# EAGLE design DBG-002 (EAGLE 9.6.0)
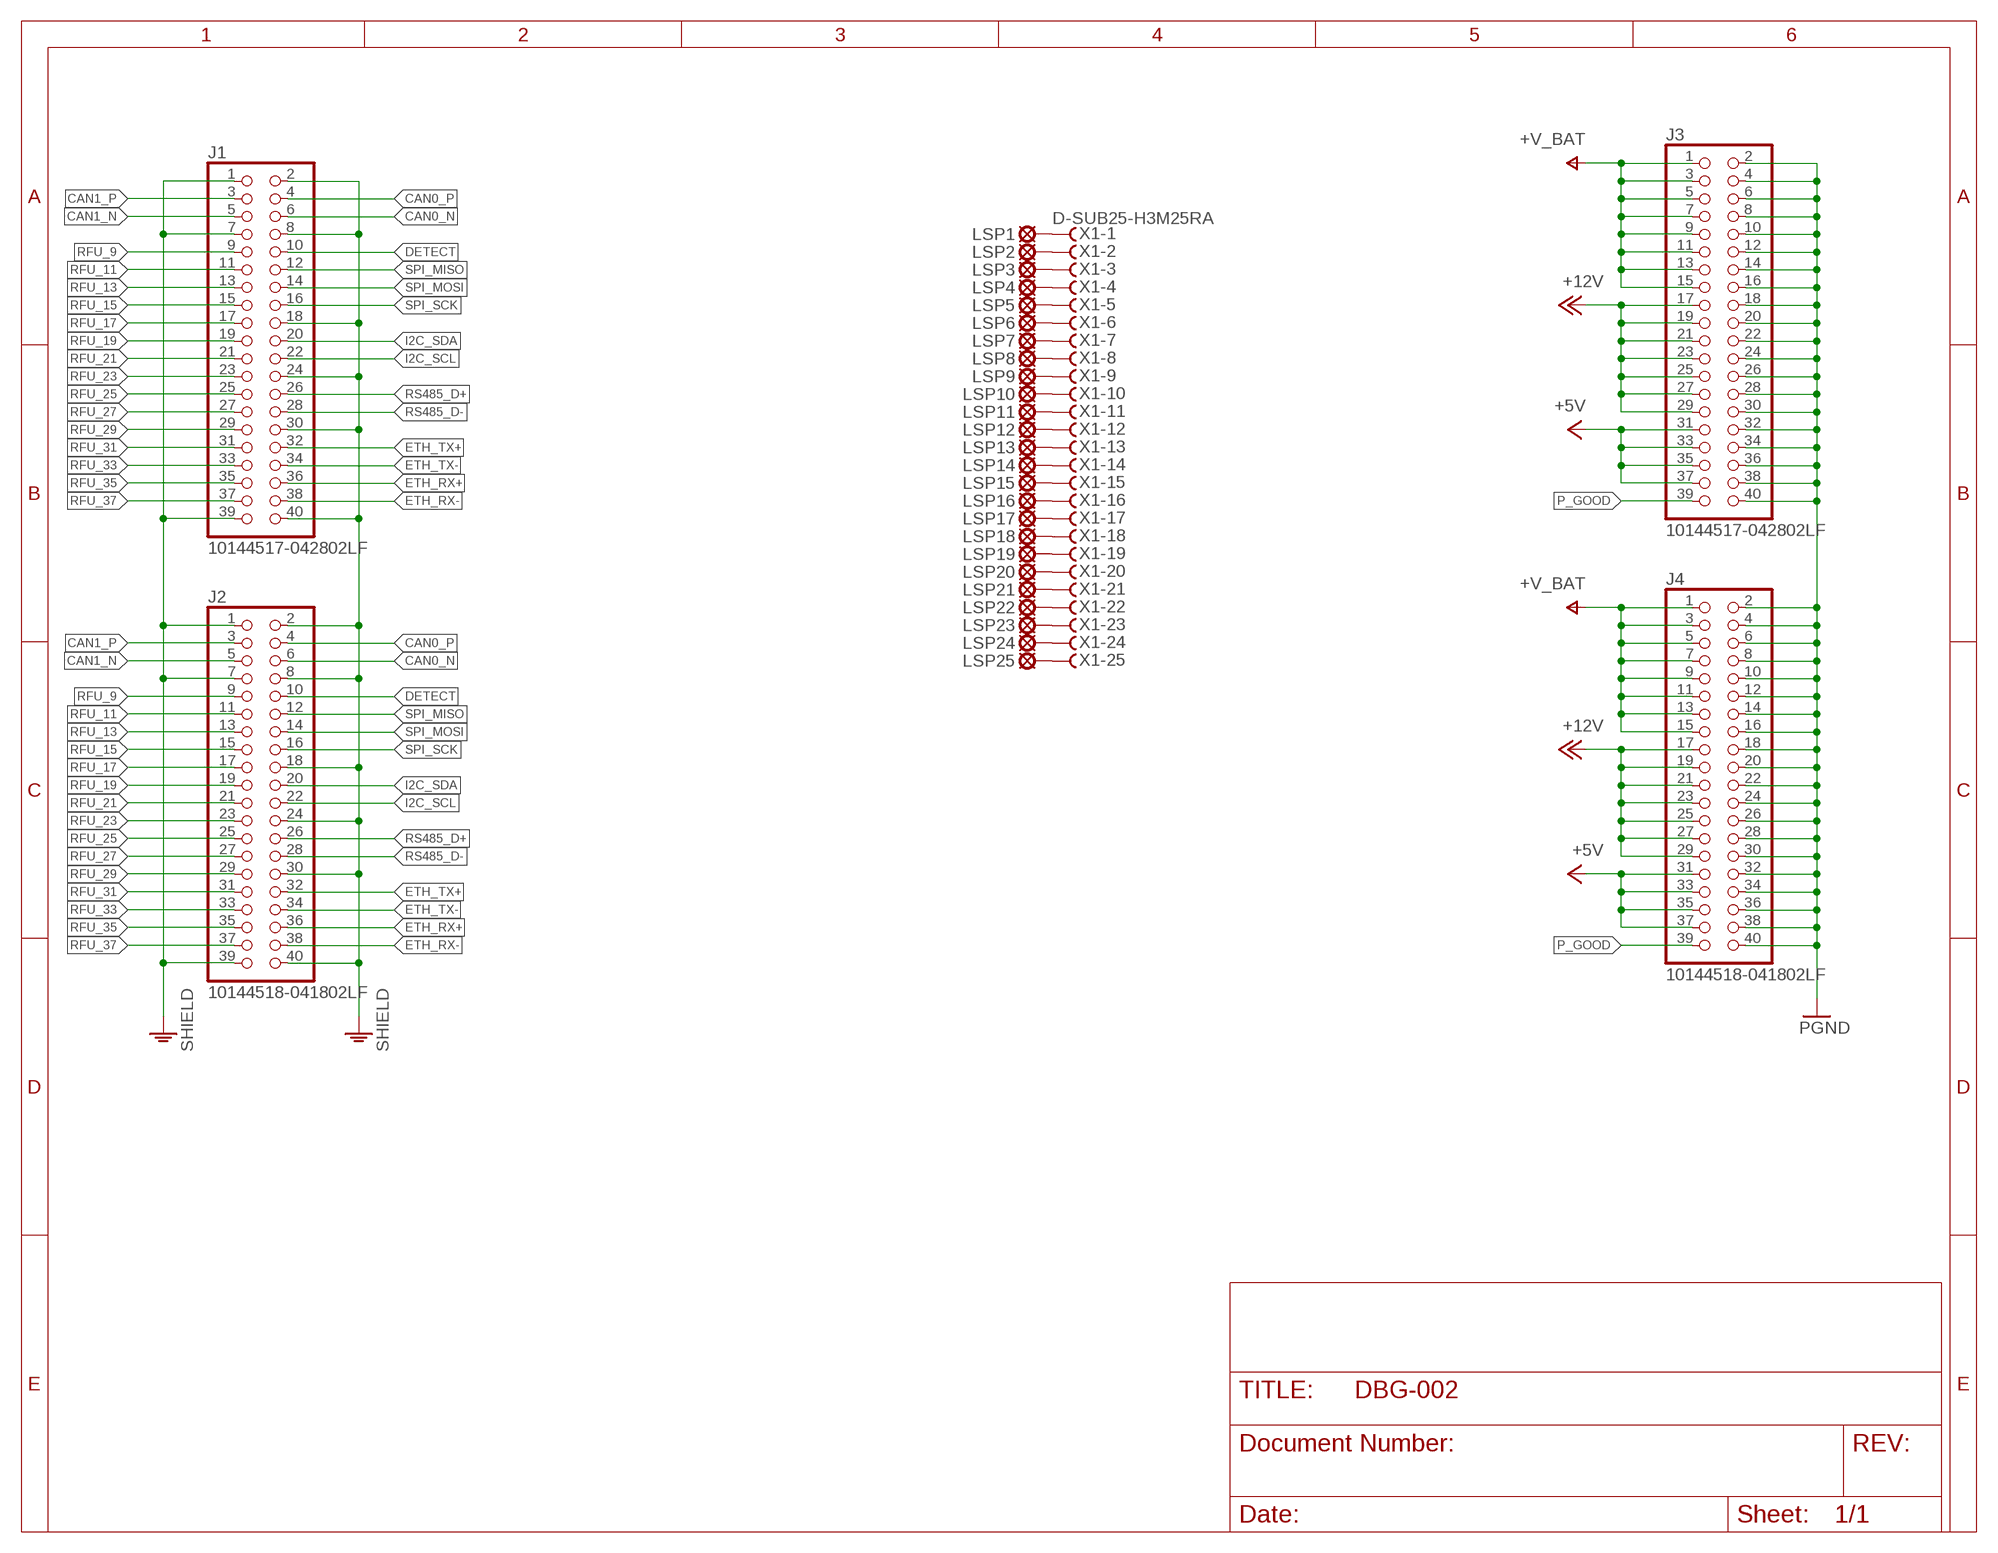
[diagram p0: schematic, sheet 1]

## Parts
J1  10144517-042802LF  [10144517-042802LF]
J2  10144518-041802LF  [10144518-041802LF]
J3  10144517-042802LF  [10144517-042802LF]
J4  10144518-041802LF  [10144518-041802LF]
LSP1  LSP11  [LSP11]
LSP2  LSP11  [LSP11]
LSP3  LSP11  [LSP11]
LSP4  LSP11  [LSP11]
LSP5  LSP11  [LSP11]
LSP6  LSP11  [LSP11]
LSP7  LSP11  [LSP11]
LSP8  LSP11  [LSP11]
LSP9  LSP11  [LSP11]
LSP10  LSP11  [LSP11]
LSP11  LSP11  [LSP11]
LSP12  LSP11  [LSP11]
LSP13  LSP11  [LSP11]
LSP14  LSP11  [LSP11]
LSP15  LSP11  [LSP11]
LSP16  LSP11  [LSP11]
LSP17  LSP11  [LSP11]
LSP18  LSP11  [LSP11]
LSP19  LSP11  [LSP11]
LSP20  LSP11  [LSP11]
LSP21  LSP11  [LSP11]
LSP22  LSP11  [LSP11]
LSP23  LSP11  [LSP11]
LSP24  LSP11  [LSP11]
LSP25  LSP11  [LSP11]
X1  D-SUB25-H3M25RA  [H3M25RA]

## Nets
+5V: J3.31 J3.33 J3.35 J3.37 J4.31 J4.33 J4.35 J4.37
+12V: J3.17 J3.19 J3.21 J3.23 J3.25 J3.27 J3.29 J4.17 J4.19 J4.21 J4.23 J4.25 J4.27 J4.29
+V_BAT: J3.1 J3.3 J3.5 J3.7 J3.9 J3.11 J3.13 J3.15 J4.1 J4.3 J4.5 J4.7 J4.9 J4.11 J4.13 J4.15
CAN0_N: J1.6 J2.6
CAN0_P: J1.4 J2.4
CAN1_N: J1.5 J2.5
CAN1_P: J1.3 J2.3
DETECT: J1.10 J2.10
ETH_RX+: J1.36 J2.36
ETH_RX-: J1.38 J2.38
ETH_TX+: J1.32 J2.32
ETH_TX-: J1.34 J2.34
I2C_SCL: J1.22 J2.22
I2C_SDA: J1.20 J2.20
N$1: LSP1.MP X1.1
N$2: LSP2.MP X1.2
N$3: LSP3.MP X1.3
N$6: LSP4.MP X1.4
N$7: LSP5.MP X1.5
N$8: LSP6.MP X1.6
N$9: LSP7.MP X1.7
N$10: LSP8.MP X1.8
N$11: LSP9.MP X1.9
N$13: LSP10.MP X1.10
N$14: LSP11.MP X1.11
N$15: LSP12.MP X1.12
N$16: LSP13.MP X1.13
N$17: LSP14.MP X1.14
N$18: LSP15.MP X1.15
N$20: LSP16.MP X1.16
N$21: LSP17.MP X1.17
N$22: LSP18.MP X1.18
N$23: LSP19.MP X1.19
N$24: LSP20.MP X1.20
N$25: LSP21.MP X1.21
N$26: LSP22.MP X1.22
N$27: LSP23.MP X1.23
N$28: LSP24.MP X1.24
N$29: LSP25.MP X1.25
P_GOOD: J3.39 J4.39
PGND: J3.2 J3.4 J3.6 J3.8 J3.10 J3.12 J3.14 J3.16 J3.18 J3.20 J3.22 J3.24 J3.26 J3.28 J3.30 J3.32 J3.34 J3.36 J3.38 J3.40 J4.2 J4.4 J4.6 J4.8 J4.10 J4.12 J4.14 J4.16 J4.18 J4.20 J4.22 J4.24 J4.26 J4.28 J4.30 J4.32 J4.34 J4.36 J4.38 J4.40
RFU_9: J1.9 J2.9
RFU_11: J1.11 J2.11
RFU_13: J1.13 J2.13
RFU_15: J1.15 J2.15
RFU_17: J1.17 J2.17
RFU_19: J1.19 J2.19
RFU_21: J1.21 J2.21
RFU_23: J1.23 J2.23
RFU_25: J1.25 J2.25
RFU_27: J1.27 J2.27
RFU_29: J1.29 J2.29
RFU_31: J1.31 J2.31
RFU_33: J1.33 J2.33
RFU_35: J1.35 J2.35
RFU_37: J1.37 J2.37
RS485_D+: J1.26 J2.26
RS485_D-: J1.28 J2.28
SHIELD: J1.1 J1.2 J1.7 J1.8 J1.18 J1.24 J1.30 J1.39 J1.40 J2.1 J2.2 J2.7 J2.8 J2.18 J2.24 J2.30 J2.39 J2.40
SPI_MISO: J1.12 J2.12
SPI_MOSI: J1.14 J2.14
SPI_SCK: J1.16 J2.16

## Library data of the parts
J1 J3 = BergStak:10144517-04
J2 J4 = BergStak:10144518-04
LSP1-LSP25 = solpad:LSP11: SOLDER PAD drill 1.1 mm
X1 = con-thomas-betts:D-SUB25-: D-Subminiatur Connector Source: Electronioc Interconnects European Edition 1998; OC_FARNELL: unknown; OC_NEWARK: unknown

## Board
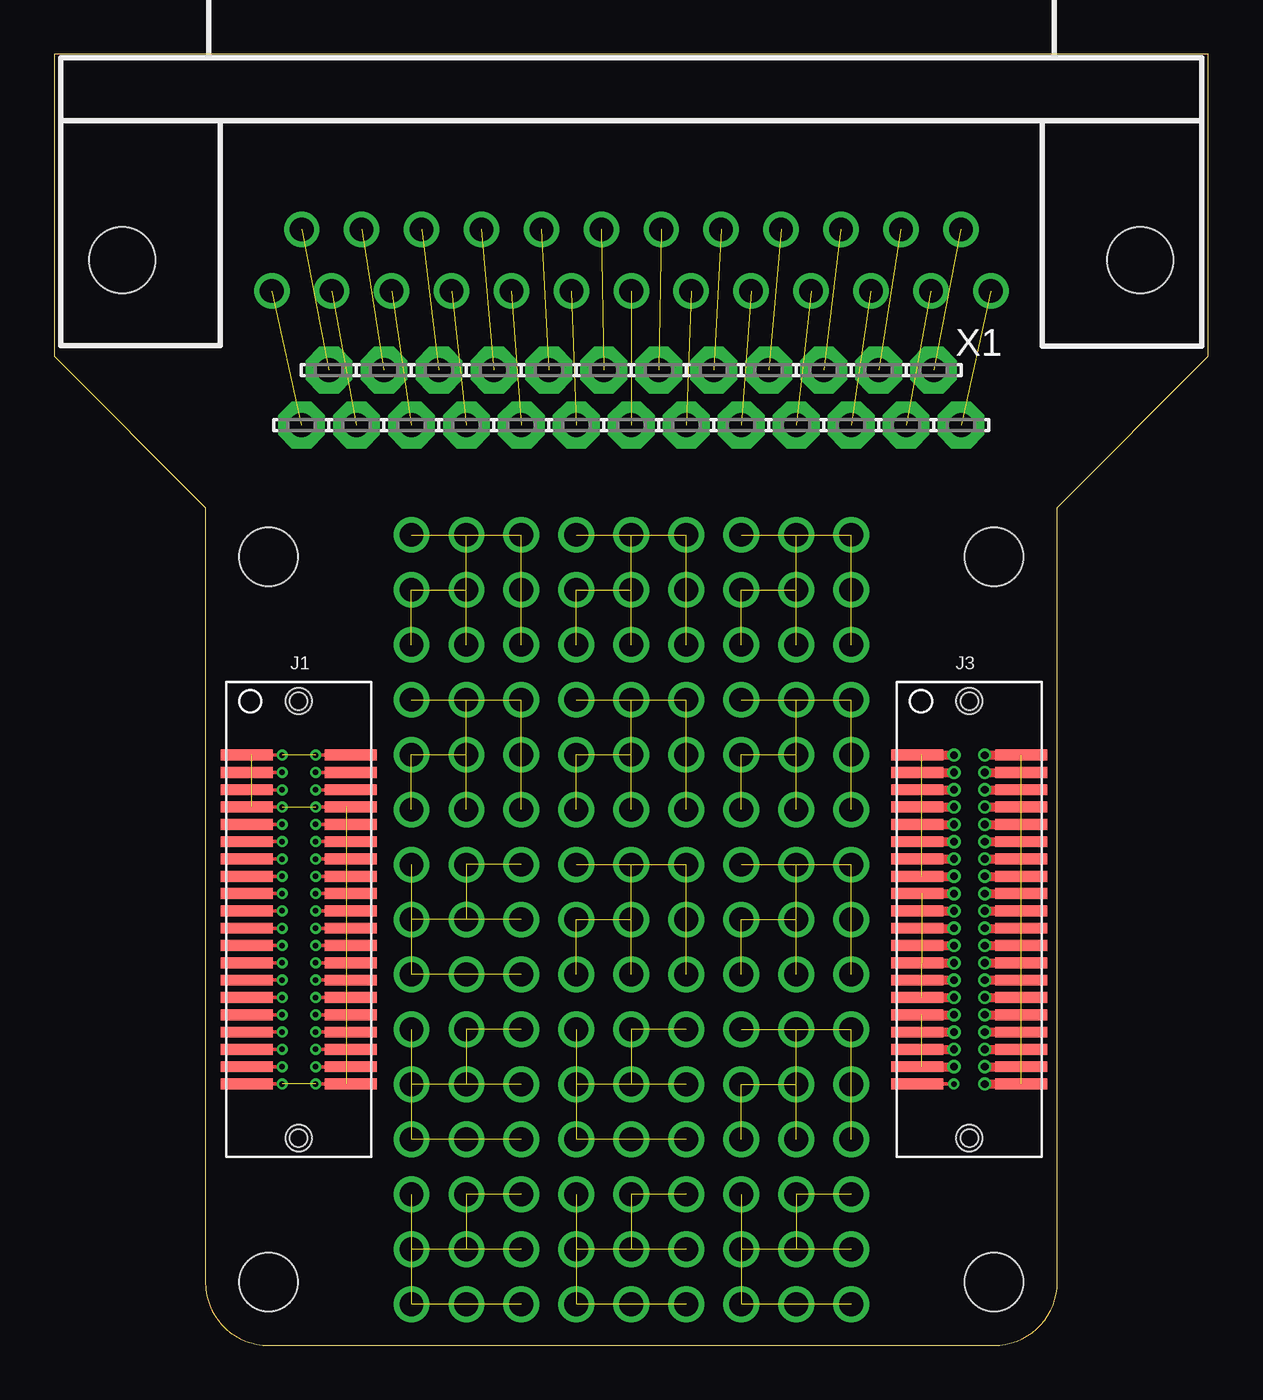
[diagram p1: board, top side]
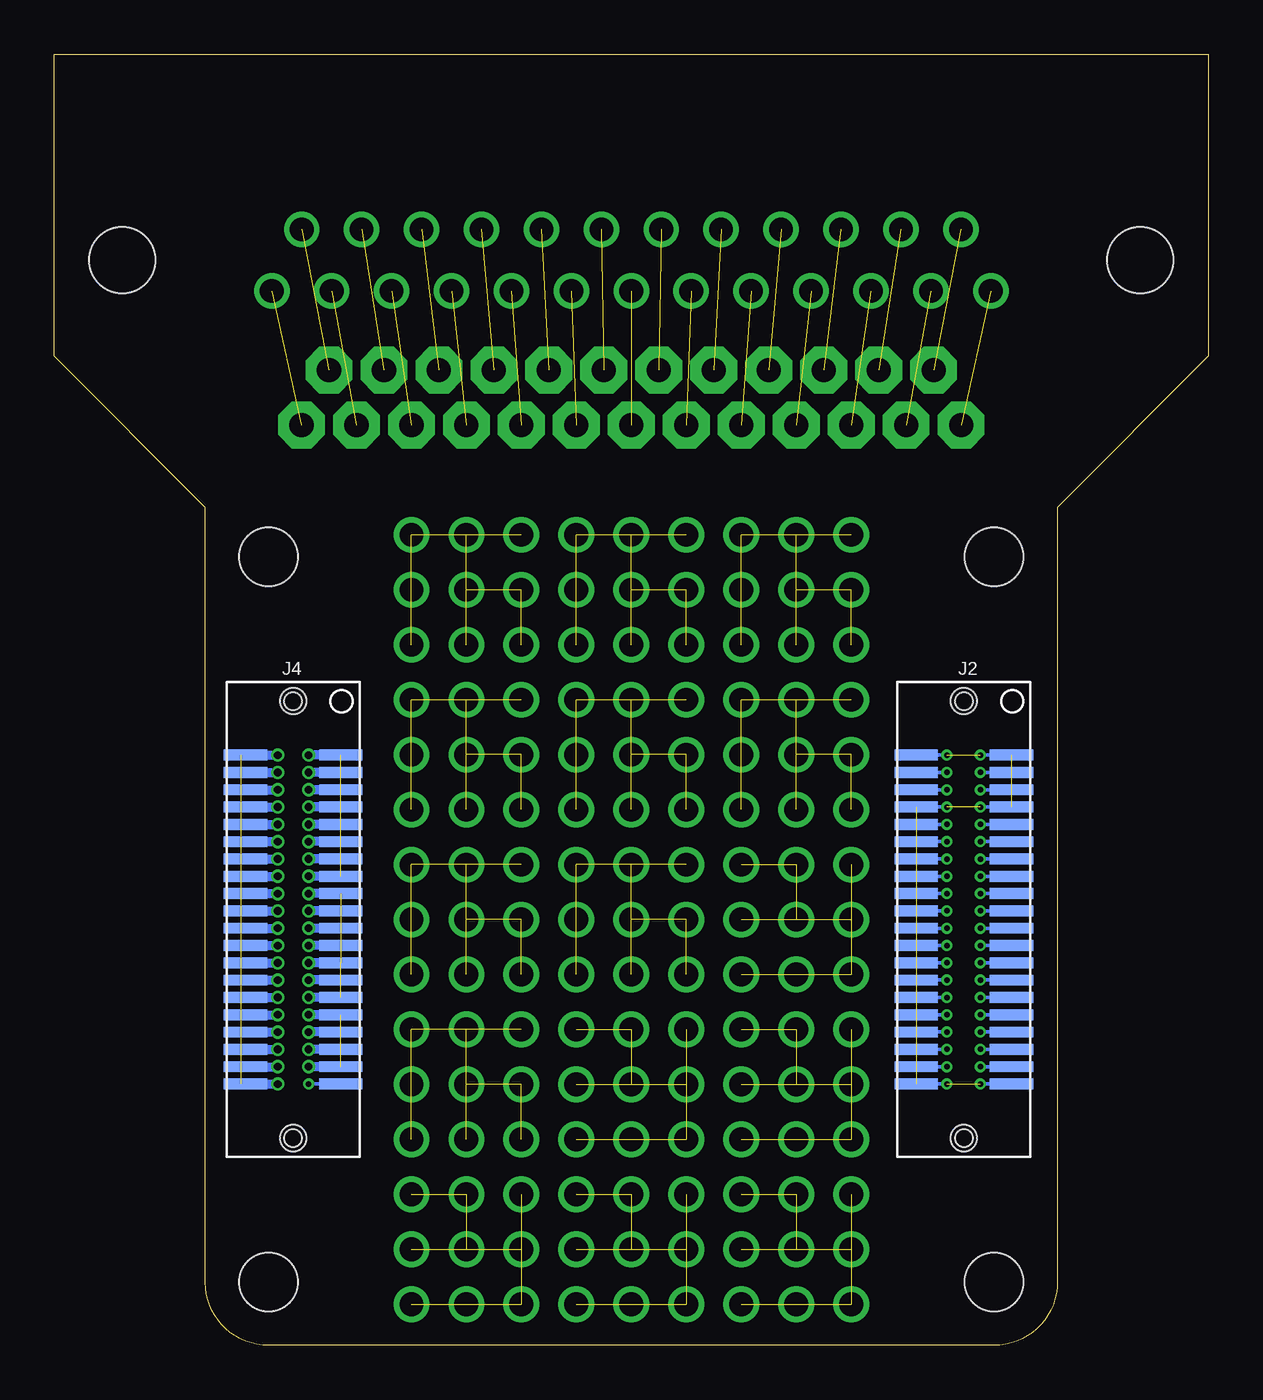
[diagram p2: board, bottom side, seen from below]

Size 53.34 x 59.69 mm. Coordinates in mm from the lower left corner, seen from the top.
Outline: 6.99,36.45 6.99,2.92 arc90 9.91,0 43.43,0 arc90 46.36,2.92 46.36,36.45 46.36,38.73 53.34,45.72 53.34,59.69 0,59.69 0,45.72 6.99,38.73 6.99,36.45
Copper layers (1*16): Top 0.035559375mm / dielectric 1.6mm / Bottom 0.035559375mm
Design rules "oshpark-2layer": minimum track width 6mil, minimum drill 10mil, track to track 6mil, track to pad 6mil, pad to pad 6mil, via to via 6mil, smd to smd 6mil, copper to edge 15mil, drill to drill 6mil, minimum pad ring 5mil, minimum via ring 5mil, stop-mask expansion 2.5mil, vias tented up to drill 0mil, thermal gap 10mil
Holes 2.69 mm at 9.91,36.45 43.43,36.45 43.43,2.92 9.91,2.92
vRestrict: area 26.7,19.7 to 32.5,25.5; area 60.2,19.7 to 66,25.5; area 60.2,53.2 to 66,59.1; area 26.7,53.2 to 32.5,59.1

### Footprints (pad centres in the part's own frame; a part is rotated, then mirrored left to right if it is on the bottom)
10144517-042802LF = smd 0.5 x 2.4: 1 7.6,2.4; 2 7.6,-2.4; 3 6.8,2.4; 4 6.8,-2.4; 5 6,2.4; 6 6,-2.4; 7 5.2,2.4; 8 5.2,-2.4; 9 4.4,2.4; 10 4.4,-2.4; 11 3.6,2.4; 12 3.6,-2.4; 13 2.8,2.4; 14 2.8,-2.4; 15 2,2.4; 16 2,-2.4; 17 1.2,2.4; 18 1.2,-2.4; 19 0.4,2.4; 20 0.4,-2.4; 21 -0.4,2.4; 22 -0.4,-2.4; 23 -1.2,2.4; 24 -1.2,-2.4; 25 -2,2.4; 26 -2,-2.4; 27 -2.8,2.4; 28 -2.8,-2.4; 29 -3.6,2.4; 30 -3.6,-2.4; 31 -4.4,2.4; 32 -4.4,-2.4; 33 -5.2,2.4; 34 -5.2,-2.4; 35 -6,2.4; 36 -6,-2.4; 37 -6.8,2.4; 38 -6.8,-2.4; 39 -7.6,2.4; 40 -7.6,-2.4 | hole 1.2: 10.1,0 | hole 0.8: -10.1,0
10144518-041802LF = smd 0.5 x 2: 1 -7.6,2.2; 2 -7.6,-2.2; 3 -6.8,2.2; 4 -6.8,-2.2; 5 -6,2.2; 6 -6,-2.2; 7 -5.2,2.2; 8 -5.2,-2.2; 9 -4.4,2.2; 10 -4.4,-2.2; 11 -3.6,2.2; 12 -3.6,-2.2; 13 -2.8,2.2; 14 -2.8,-2.2; 15 -2,2.2; 16 -2,-2.2; 17 -1.2,2.2; 18 -1.2,-2.2; 19 -0.4,2.2; 20 -0.4,-2.2; 21 0.4,2.2; 22 0.4,-2.2; 23 1.2,2.2; 24 1.2,-2.2; 25 2,2.2; 26 2,-2.2; 27 2.8,2.2; 28 2.8,-2.2; 29 3.6,2.2; 30 3.6,-2.2; 31 4.4,2.2; 32 4.4,-2.2; 33 5.2,2.2; 34 5.2,-2.2; 35 6,2.2; 36 6,-2.2; 37 6.8,2.2; 38 6.8,-2.2; 39 7.6,2.2; 40 7.6,-2.2 | hole 1.2: 10.1,0 | hole 0.8: -10.1,0
LSP11 = drill 1.118 pad 2.159 octagon: MP 0,0
H3M25RA = drill 1.092: 1 -16.612,1.422; 2 -13.843,1.422; 3 -11.074,1.422; 4 -8.306,1.422; 5 -5.537,1.422; 6 -2.769,1.422; 7 0,1.422; 8 2.769,1.422; 9 5.537,1.422; 10 8.306,1.422; 11 11.074,1.422; 12 13.843,1.422; 13 16.612,1.422; 14 -15.227,-1.422; 15 -12.459,-1.422; 16 -9.69,-1.422; 17 -6.921,-1.422; 18 -4.153,-1.422; 19 -1.384,-1.422; 20 1.384,-1.422; 21 4.153,-1.422; 22 6.921,-1.422; 23 9.69,-1.422; 24 12.459,-1.422; 25 15.227,-1.422 | hole 3.048: -23.52,0; 23.52,0

### Placement (x,y rotation side)
J1  11.3,19.68 90 top
J2  11.3,19.68 270 bottom
J3  42.29,19.68 90 top
J4  42.29,19.68 270 bottom
LSP1  41.91,42.55 180 top
LSP2  39.37,42.55 180 top
LSP3  36.83,42.55 180 top
LSP4  34.29,42.55 180 top
LSP5  31.75,42.55 180 top
LSP6  29.21,42.55 180 top
LSP7  26.67,42.55 180 top
LSP8  24.13,42.55 180 top
LSP9  21.59,42.55 180 top
LSP10  19.05,42.55 180 top
LSP11  16.51,42.55 180 top
LSP12  13.97,42.55 180 top
LSP13  11.43,42.55 180 top
LSP14  40.64,45.08 180 top
LSP15  38.1,45.08 180 top
LSP16  35.56,45.08 180 top
LSP17  33.02,45.08 180 top
LSP18  30.48,45.08 180 top
LSP19  27.94,45.08 180 top
LSP20  25.4,45.08 180 top
LSP21  22.86,45.08 180 top
LSP22  20.32,45.08 180 top
LSP23  17.78,45.08 180 top
LSP24  15.24,45.08 180 top
LSP25  12.7,45.08 180 top
X1  26.67,50.16 180 top

### Tracks (layer width: path | path; a pad name or v marks a point on that pad's centre or on a via)
+5V  (via drill 0.36)  (3 unrouted)
  Top 0.406: J3.37 v41.58,12.88 | J3.35 v41.58,13.68 | J3.33 v41.58,14.48 | J3.31 v41.58,15.28
  Bottom 0.406: J4.37 v41.58,12.88 | J4.35 v41.58,13.68 | J4.33 v41.58,14.48 | J4.31 v41.58,15.28
+12V  (via drill 0.36)  (6 unrouted)
  Top 0.406: J3.29 v41.58,16.08 | J3.27 v41.58,16.88 | J3.25 v41.58,17.68 | J3.23 v41.58,18.48 | J3.21 v41.58,19.29 | J3.19 v41.58,20.08 | J3.17 v41.58,20.88
  Bottom 0.406: J4.29 v41.58,16.08 | J4.27 v41.58,16.88 | J4.25 v41.58,17.68 | J4.23 v41.58,18.48 | J4.21 v41.58,19.29 | J4.19 v41.58,20.08 | J4.17 v41.58,20.88
+V_BAT  (via drill 0.36)  (7 unrouted)
  Top 0.406: J3.1 v41.58,27.28 | J3.3 v41.58,26.48 | J3.5 v41.58,25.68 | J3.7 v41.58,24.88 | J3.9 v41.58,24.09 | J3.11 v41.58,23.29 | J3.13 v41.58,22.48 | J3.15 v41.58,21.68
  Bottom 0.406: J4.1 v41.58,27.28 | J4.3 v41.58,26.48 | J4.5 v41.58,25.68 | J4.7 v41.58,24.88 | J4.9 v41.58,24.09 | J4.11 v41.58,23.29 | J4.13 v41.58,22.48 | J4.15 v41.58,21.68
CAN0_N  (via drill 0.25)
  Top 0.152: v12.09,25.68 J1.6
  Bottom 0.152: v12.09,25.68 J2.6
CAN0_P  (via drill 0.25)
  Top 0.152: v12.09,26.48 J1.4
  Bottom 0.152: J2.4 v12.09,26.48
CAN1_N  (via drill 0.25)
  Top 0.152: J1.5 v10.54,25.68
  Bottom 0.152: v10.54,25.68 J2.5
CAN1_P  (via drill 0.25)
  Top 0.152: J1.3 v10.54,26.48
  Bottom 0.152: v10.54,26.48 J2.3
DETECT  (via drill 0.25)
  Top 0.152: v12.09,24.09 J1.10
  Bottom 0.152: J2.10 v12.09,24.09
ETH_RX+  (via drill 0.25)
  Top 0.152: v12.09,13.68 J1.36
  Bottom 0.152: J2.36 v12.09,13.68
ETH_RX-  (via drill 0.25)
  Top 0.152: v12.09,12.88 J1.38
  Bottom 0.152: J2.38 v12.09,12.88
ETH_TX+  (via drill 0.25)
  Top 0.152: v12.09,15.28 J1.32
  Bottom 0.152: J2.32 v12.09,15.28
ETH_TX-  (via drill 0.25)
  Top 0.152: v12.09,14.48 J1.34
  Bottom 0.152: J2.34 v12.09,14.48
I2C_SCL  (via drill 0.25)
  Top 0.152: v12.09,19.29 J1.22
  Bottom 0.152: J2.22 v12.09,19.29
I2C_SDA  (via drill 0.25)
  Top 0.152: v12.09,20.08 J1.20
  Bottom 0.152: J2.20 v12.09,20.08
N$1  (1 unrouted)
N$2  (1 unrouted)
N$3  (1 unrouted)
N$4  (via drill 1.1)  (8 unrouted)
  other vias: 26.67,19.68 26.67,22.22 24.13,22.22 24.13,19.68 29.21,19.68 29.21,22.22 24.13,17.14 26.67,17.14 29.21,17.14
N$5  (via drill 1.1)  (8 unrouted)
  other vias: 26.67,27.3 26.67,29.84 24.13,29.84 24.13,27.3 29.21,27.3 29.21,29.84 24.13,24.77 26.67,24.77 29.21,24.77
N$6  (1 unrouted)
N$7  (1 unrouted)
N$8  (1 unrouted)
N$9  (1 unrouted)
N$10  (1 unrouted)
N$11  (1 unrouted)
N$12  (via drill 1.1)  (8 unrouted)
  other vias: 34.29,27.3 34.29,29.84 31.75,29.84 31.75,27.3 36.83,27.3 36.83,29.84 31.75,24.77 34.29,24.77 36.83,24.77
N$13  (1 unrouted)
N$14  (1 unrouted)
N$15  (1 unrouted)
N$16  (1 unrouted)
N$17  (1 unrouted)
N$18  (1 unrouted)
N$19  (via drill 1.1)  (8 unrouted)
  other vias: 34.29,19.68 34.29,22.22 31.75,22.22 31.75,19.68 36.83,19.68 36.83,22.22 31.75,17.14 34.29,17.14 36.83,17.14
N$20  (1 unrouted)
N$21  (1 unrouted)
N$22  (1 unrouted)
N$23  (1 unrouted)
N$24  (1 unrouted)
N$25  (1 unrouted)
N$26  (1 unrouted)
N$27  (1 unrouted)
N$28  (1 unrouted)
N$29  (1 unrouted)
N$30  (via drill 1.1)  (8 unrouted)
  other vias: 34.29,12.06 34.29,14.6 31.75,14.6 31.75,12.06 36.83,12.06 36.83,14.6 31.75,9.52 34.29,9.52 36.83,9.52
N$31  (via drill 1.1)  (8 unrouted)
  other vias: 26.67,12.06 26.67,14.6 24.13,14.6 24.13,12.06 29.21,12.06 29.21,14.6 24.13,9.52 26.67,9.52 29.21,9.52
N$32  (via drill 1.1)  (8 unrouted)
  other vias: 19.05,12.06 19.05,14.6 16.51,14.6 16.51,12.06 21.59,12.06 21.59,14.6 16.51,9.52 19.05,9.52 21.59,9.52
N$33  (via drill 1.1)  (8 unrouted)
  other vias: 19.05,19.68 19.05,22.22 16.51,22.22 16.51,19.68 21.59,19.68 21.59,22.22 16.51,17.14 19.05,17.14 21.59,17.14
N$34  (via drill 1.1)  (8 unrouted)
  other vias: 19.05,27.3 19.05,29.84 16.51,29.84 16.51,27.3 21.59,27.3 21.59,29.84 16.51,24.77 19.05,24.77 21.59,24.77
N$35  (via drill 1.1)  (8 unrouted)
  other vias: 19.05,4.44 19.05,6.98 16.51,6.98 16.51,4.44 21.59,4.44 21.59,6.98 16.51,1.9 19.05,1.9 21.59,1.9
N$36  (via drill 1.1)  (8 unrouted)
  other vias: 26.67,4.44 26.67,6.98 24.13,6.98 24.13,4.44 29.21,4.44 29.21,6.98 24.13,1.9 26.67,1.9 29.21,1.9
N$37  (via drill 1.1)  (8 unrouted)
  other vias: 34.29,4.44 34.29,6.98 31.75,6.98 31.75,4.44 36.83,4.44 36.83,6.98 31.75,1.9 34.29,1.9 36.83,1.9
N$38  (via drill 1.1)  (8 unrouted)
  other vias: 19.05,34.92 19.05,37.47 16.51,37.47 16.51,34.92 21.59,34.92 21.59,37.47 16.51,32.38 19.05,32.38 21.59,32.38
N$39  (via drill 1.1)  (8 unrouted)
  other vias: 26.67,34.92 26.67,37.47 24.13,37.47 24.13,34.92 29.21,34.92 29.21,37.47 24.13,32.38 26.67,32.38 29.21,32.38
N$40  (via drill 1.1)  (8 unrouted)
  other vias: 34.29,34.92 34.29,37.47 31.75,37.47 31.75,34.92 36.83,34.92 36.83,37.47 31.75,32.38 34.29,32.38 36.83,32.38
P_GOOD  (via drill 0.25)
  Top 0.152: J3.39 v41.58,12.08
  Bottom 0.152: J4.39 v41.58,12.08
PGND  (via drill 0.36)  (19 unrouted)
  Top 0.406: v43,27.28 J3.2 | v43,26.48 J3.4 | v43,25.68 J3.6 | v43,24.88 J3.8 | v43,14.48 J3.34 | v43,13.68 J3.36 | v43,12.88 J3.38 | v43,12.08 J3.40 | v43,17.68 J3.26 | v43,16.88 J3.28 | v43,16.08 J3.30 | v43,15.28 J3.32 | v43,20.88 J3.18 | v43,20.08 J3.20 | v43,19.29 J3.22 | v43,18.48 J3.24 | v43,24.09 J3.10 | v43,23.29 J3.12 | v43,22.48 J3.14 | v43,21.68 J3.16
  Bottom 0.406: J4.2 v43,27.28 | J4.4 v43,26.48 | J4.6 v43,25.68 | J4.8 v43,24.88 | J4.34 v43,14.48 | J4.36 v43,13.68 | J4.38 v43,12.88 | J4.40 v43,12.08 | J4.26 v43,17.68 | J4.28 v43,16.88 | J4.30 v43,16.08 | J4.32 v43,15.28 | J4.18 v43,20.88 | J4.20 v43,20.08 | J4.22 v43,19.29 | J4.24 v43,18.48 | J4.10 v43,24.09 | J4.12 v43,23.29 | J4.14 v43,22.48 | J4.16 v43,21.68
RFU_9  (via drill 0.25)
  Top 0.152: J1.9 v10.54,24.09
  Bottom 0.152: J2.9 v10.54,24.09
RFU_11  (via drill 0.25)
  Top 0.152: J1.11 v10.54,23.29
  Bottom 0.152: J2.11 v10.54,23.29
RFU_13  (via drill 0.25)
  Top 0.152: J1.13 v10.54,22.48
  Bottom 0.152: J2.13 v10.54,22.48
RFU_15  (via drill 0.25)
  Top 0.152: J1.15 v10.54,21.68
  Bottom 0.152: J2.15 v10.54,21.68
RFU_17  (via drill 0.25)
  Top 0.152: J1.17 v10.54,20.88
  Bottom 0.152: J2.17 v10.54,20.88
RFU_19  (via drill 0.25)
  Top 0.152: J1.19 v10.54,20.08
  Bottom 0.152: J2.19 v10.54,20.08
RFU_21  (via drill 0.25)
  Top 0.152: J1.21 v10.54,19.29
  Bottom 0.152: J2.21 v10.54,19.29
RFU_23  (via drill 0.25)
  Top 0.152: J1.23 v10.54,18.48
  Bottom 0.152: J2.23 v10.54,18.48
RFU_25  (via drill 0.25)
  Top 0.152: J1.25 v10.54,17.68
  Bottom 0.152: J2.25 v10.54,17.68
RFU_27  (via drill 0.25)
  Top 0.152: J1.27 v10.54,16.88
  Bottom 0.152: J2.27 v10.54,16.88
RFU_29  (via drill 0.25)
  Top 0.152: J1.29 v10.54,16.08
  Bottom 0.152: J2.29 v10.54,16.08
RFU_31  (via drill 0.25)
  Top 0.152: J1.31 v10.54,15.28
  Bottom 0.152: J2.31 v10.54,15.28
RFU_33  (via drill 0.25)
  Top 0.152: J1.33 v10.54,14.48
  Bottom 0.152: J2.33 v10.54,14.48
RFU_35  (via drill 0.25)
  Top 0.152: J1.35 v10.54,13.68
  Bottom 0.152: J2.35 v10.54,13.68
RFU_37  (via drill 0.25)
  Top 0.152: J1.37 v10.54,12.88
  Bottom 0.152: J2.37 v10.54,12.88
RS485_D+  (via drill 0.25)
  Top 0.152: v12.09,17.68 J1.26
  Bottom 0.152: J2.26 v12.09,17.68
RS485_D-  (via drill 0.25)
  Top 0.152: v12.09,16.88 J1.28
  Bottom 0.152: J2.28 v12.09,16.88
SHIELD  (via drill 0.25)  (8 unrouted)
  Top 0.152: J1.1 v10.54,27.28 | v12.09,12.08 J1.40 | J1.39 v10.54,12.08 | v12.09,16.08 J1.30 | v12.09,18.48 J1.24 | v12.09,20.88 J1.18 | v12.09,24.88 J1.8 | v12.09,27.28 J1.2 | J1.7 v10.54,24.88
  Bottom 0.152: J2.1 v10.54,27.28 | J2.40 v12.09,12.08 | J2.39 v10.54,12.08 | J2.30 v12.09,16.08 | J2.24 v12.09,18.48 | J2.18 v12.09,20.88 | J2.8 v12.09,24.88 | J2.2 v12.09,27.28 | J2.7 v10.54,24.88
SPI_MISO  (via drill 0.25)
  Top 0.152: v12.09,23.29 J1.12
  Bottom 0.152: J2.12 v12.09,23.29
SPI_MOSI  (via drill 0.25)
  Top 0.152: v12.09,22.48 J1.14
  Bottom 0.152: J2.14 v12.09,22.48
SPI_SCK  (via drill 0.25)
  Top 0.152: v12.09,21.68 J1.16
  Bottom 0.152: J2.16 v12.09,21.68